# Altium project FMC_130MSPS.PrjPCB (part 3 of 3)

## Sheet ADC.SchDoc: ADC
size 420 x 297 mm; SheetNumber: 2; SheetTotal: 8
Used 4 times, as channels U_ADC1, U_ADC2, U_ADC3, U_ADC4. Parts and nets are listed once, with the designators drawn on the sheet.
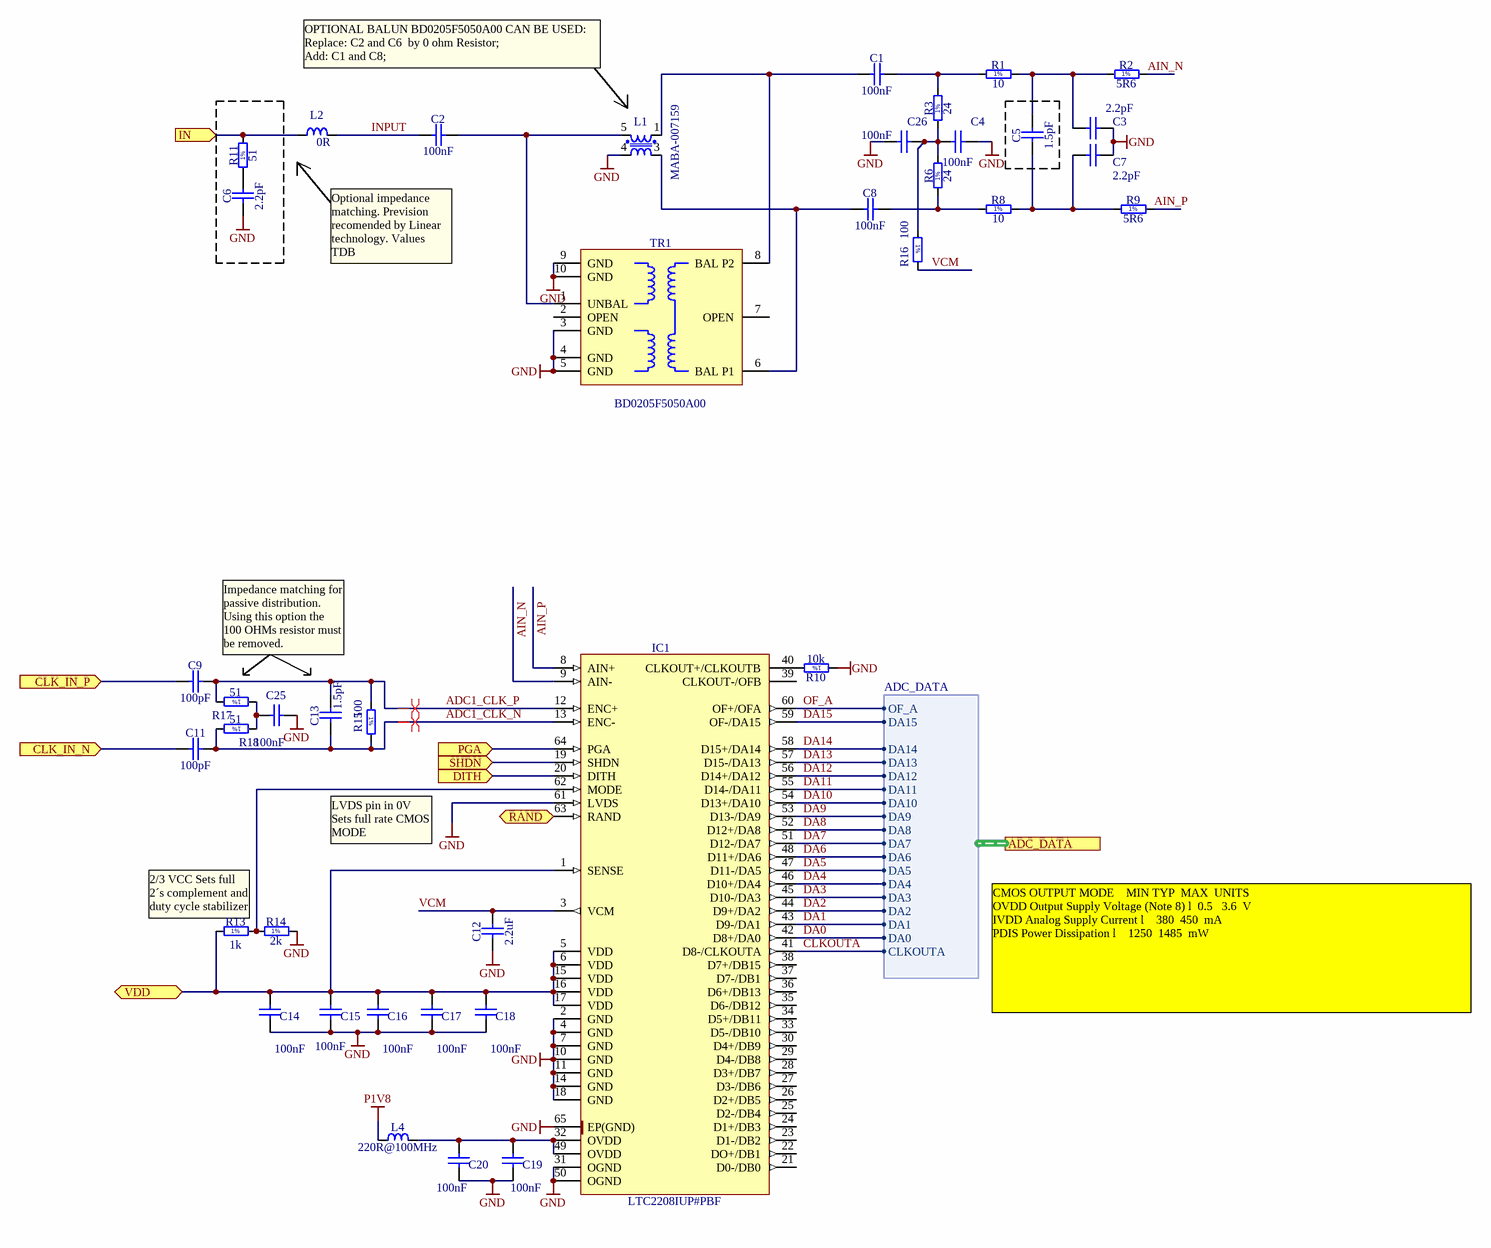
[diagram p5: ADC.SchDoc]

### Parts
C1  100nF  [CAPC0603X33N]
C2  100nF  [CAPC0603X33N]
C3  2.2pF  [CAPC1005X55N]
C4  100nF  [CAPC0603X33N]
C5  1.5pF  [CAPC1005X55N]
C6  2.2pF  [CAPC1005X55N]
C7  2.2pF  [CAPC1005X55N]
C8  100nF  [CAPC0603X33N]
C9  100pF  [CAPC1005X55N]
C11  100pF  [CAPC1005X55N]
C12  2.2uF  [CAPC1608X87N]
C13  1.5pF  [CAPC1005X55N]
C14  100nF  [CAPC0603X33N]
C15  100nF  [CAPC0603X33N]
C16  100nF  [CAPC0603X33N]
C17  100nF  [CAPC0603X33N]
C18  100nF  [CAPC0603X33N]
C19  100nF  [CAPC0603X33N]
C20  100nF  [CAPC0603X33N]
C25  100nF  [CAPC0603X33N]
C26  100nF  [CAPC0603X33N]
IC1  LTC2208IUP#PBF  [QFN50P900X900X80-65N-S725]
L1  MABA-007159  [XFMR_MA-COM_SM-22 (H260)]
L2  0R  [INDC1005X55N]
L4  220R@100MHz  [INDC2012X105N]
R1  10  [RESC1005X40N]
R2  5R6  [RESC1005X40N]
R3  24  [RESC1005X40N]
R6  24  [RESC1005X40N]
R8  10  [RESC1005X40N]
R9  5R6  [RESC1005X40N]
R10  10k  [RESC1005X40N]
R11  51  [RESC1005X40N]
R13  1k  [RESC1005X40N]
R14  2k  [RESC1005X40N]
R15  100  [RESC1005X40N]
R16  100  [RESC1005X40N]
R17  51  [RESC1005X40N]
R18  51  [RESC1005X40N]
TR1  BD0205F5050A00  [XFMR_ANAREN_BD0205F5050A00]

### Ports
ADC_DATA (harness ADC_DATA), CLK_IN_N (in), CLK_IN_P (in), DITH (in), IN (in), PGA (in), RAND (in), SHDN (in), VDD

### Harnesses
ADC_DATA: CLKOUTA, DA0, DA1, DA2, DA3, DA4, DA5, DA6, DA7, DA8, DA9, DA10, DA11, DA12, DA13, DA14, DA15, OF_A

### Nets
GND: C3.2 C4.2 C6.1 C7.2 C12.1 C14.1 C15.1 C16.1 C17.1 C18.1 C19.1 C20.1 C25.1 C26.2 IC1.2(GND) IC1.4(GND) IC1.7(GND) IC1.10(GND) IC1.11(GND) IC1.14(GND) IC1.18(GND) IC1.31(OGND) IC1.50(OGND) IC1.61(LVDS) IC1.65(EP(GND)) L1.4 R10.1 R14.2 TR1.3(GND) TR1.4(GND) TR1.5(GND) TR1.9(GND) TR1.10(GND)
P1V8: L4.1
ADC1_CLK_N: C11.2 C13.1 IC1.13(ENC-) R15.2 R18.2
ADC1_CLK_P: C9.2 C13.2 IC1.12(ENC+) R15.1 R17.2
AIN_N: IC1.9(AIN-) R2.2
AIN_P: IC1.8(AIN+) R9.2
CLK_IN_N: C11.1 ; port CLK_IN_N
CLK_IN_P: C9.1 ; port CLK_IN_P
CLKOUTA: IC1.41(D8-/CLKOUTA) ; port ADC_DATA.CLKOUTA
DA0: IC1.42(D8+/DA0) ; port ADC_DATA.DA0
DA1: IC1.43(D9-/DA1) ; port ADC_DATA.DA1
DA2: IC1.44(D9+/DA2) ; port ADC_DATA.DA2
DA3: IC1.45(D10-/DA3) ; port ADC_DATA.DA3
DA4: IC1.46(D10+/DA4) ; port ADC_DATA.DA4
DA5: IC1.47(D11-/DA5) ; port ADC_DATA.DA5
DA6: IC1.48(D11+/DA6) ; port ADC_DATA.DA6
DA7: IC1.51(D12-/DA7) ; port ADC_DATA.DA7
DA8: IC1.52(D12+/DA8) ; port ADC_DATA.DA8
DA9: IC1.53(D13-/DA9) ; port ADC_DATA.DA9
DA10: IC1.54(D13+/DA10) ; port ADC_DATA.DA10
DA11: IC1.55(D14-/DA11) ; port ADC_DATA.DA11
DA12: IC1.56(D14+/DA12) ; port ADC_DATA.DA12
DA13: IC1.57(D15-/DA13) ; port ADC_DATA.DA13
DA14: IC1.58(D15+/DA14) ; port ADC_DATA.DA14
DA15: IC1.59(OF-/DA15) ; port ADC_DATA.DA15
DITH: IC1.20(DITH) ; port DITH
IN: L2.1 R11.2 ; port IN
INPUT: C2.1 L2.2
OF_A: IC1.60(OF+/OFA) ; port ADC_DATA.OF_A
PGA: IC1.64(PGA) ; port PGA
RAND: IC1.63(RAND) ; port RAND
SHDN: IC1.19(SHDN) ; port SHDN
VCM: C12.2 IC1.3(VCM) R16.2
VDD: C14.2 C15.2 C16.2 C17.2 C18.2 IC1.1(SENSE) IC1.5(VDD) IC1.6(VDD) IC1.15(VDD) IC1.16(VDD) IC1.17(VDD) R13.1 ; port VDD
NetC1_1: C1.1 L1.1 TR1.8(BAL_P2)
NetC1_2: C1.2 R1.1 R3.2
NetC2_2: C2.2 L1.5 TR1.1(UNBAL)
NetC3_1: C3.1 C5.2 R1.2 R2.1
NetC4_1: C4.1 C26.1 R3.1 R6.2 R16.1
NetC5_1: C5.1 C7.1 R8.2 R9.1
NetC6_2: C6.2 R11.1
NetC8_1: C8.1 L1.3 TR1.6(BAL_P1)
NetC8_2: C8.2 R6.1 R8.1
NetC19_2: C19.2 C20.2 IC1.32(OVDD) IC1.49(OVDD) L4.2
NetC25_2: C25.2 R17.1 R18.1
NetIC1_40: IC1.40(CLKOUT+/CLKOUTB) R10.2
NetIC1_62: IC1.62(MODE) R13.2 R14.1

Not connected (* = marked no-connect by the designer): IC1 21(D0-/DB0) 22(DO+/DB1) 23(D1-/DB2) 24(D1+/DB3) 25(D2-/DB4) 26(D2+/DB5) 27(D3-/DB6) 28(D3+/DB7) 29(D4-/DB8) 30(D4+/DB9) 33(D5-/DB10) 34(D5+/DB11) 35(D6-/DB12) 36(D6+/DB13) 37(D7-/DB1) 38(D7+/DB15) 39(CLKOUT-/OFB); TR1 2(OPEN) 7(OPEN)

### Channels
U_ADC1: designators end in A; ports CLK_IN_N=ADC1_CLK_N CLK_IN_P=ADC1_CLK_P DITH=DITH_ON_OFF IN=NetJ6_1 PGA=PGA_1_0 RAND=RAND_ON_OFF SHDN=SHDN_ON_OFF VDD=P3V3_ADC1
U_ADC2: designators end in B; ports CLK_IN_N=ADC2_CLK_N CLK_IN_P=ADC2_CLK_P DITH=DITH_ON_OFF IN=NetJ8_1 PGA=PGA_1_0 RAND=RAND_ON_OFF SHDN=SHDN_ON_OFF VDD=P3V3_ADC2
U_ADC3: designators end in C; ports CLK_IN_N=ADC3_CLK_N CLK_IN_P=ADC3_CLK_P DITH=DITH_ON_OFF IN=NetJ7_1 PGA=PGA_1_0 RAND=RAND_ON_OFF SHDN=SHDN_ON_OFF VDD=P3V3_ADC3
U_ADC4: designators end in D; ports CLK_IN_N=ADC4_CLK_N CLK_IN_P=ADC4_CLK_P DITH=DITH_ON_OFF IN=NetJ5_1 PGA=PGA_1_0 RAND=RAND_ON_OFF SHDN=SHDN_ON_OFF VDD=P3V3_ADC4

### Layout directives
differential pair: ADC1_CLK_N_U_ADC1, ADC1_CLK_P_U_ADC1

### Notes on the sheet
- OPTIONAL BALUN BD0205F5050A00 CAN BE USED:
  Replace: C2 and C6  by 0 ohm Resistor;
  Add: C1 and C8;
- Optional impedance matching. Prevision recomended by Linear technology. Values TDB
- Impedance matching for passive distribution. Using this option the 100 OHMs resistor must be removed.
- LVDS pin in 0V Sets full rate CMOS MODE
- 2/3 VCC Sets full 2´s complement and duty cycle stabilizer
- CMOS OUTPUT MODE 	 	MIN	TYP 	MAX 	UNITS
  OVDD Output Supply Voltage (Note 8) l 	0.5 		3.6 	V
  IVDD Analog Supply Current l 			380 	450	 mA
  PDIS Power Dissipation l 			1250 	1485 	mW
- Project/Equipment
- Document
- FMC_130MSPS_4CH
- Designer
- Drawn by
- Check.by
- Copyright Creotech Instruments SA 2014.
  This documentation describes Open Hardware and is licensed under the CERN OHL v.1.1. You may redistribute and modify this documentation under the terms of the CERN OHL v.1.1. (http://ohwr.org/CERNOHL). This documentation is distributed WITHOUT ANY EXPRESS OR IMPLIED WARRANTY, INCLUDING OF MERCHANTABILITY, SATISFACTORY QUALITY AND FITNESS FOR A PARTICULAR PURPOSE. Please see the CERN OHL v.1.1 for applicable conditions.
- Creotech Instruments S.A.
- File
- Last Mod.
- Print Date
- Sheet
- Size
- A3
- of
- Rev
- (in symbol R0402_1K_1%_0.0625W_100PPM) 1%
- (in symbol R0402_2K_1%_0.0625W_100PPM) 1%
- (in symbol R0402_5R6_1%_0.0625W_200PPM) 1%
- (in symbol R0402_10K_1%_0.0625W_100PPM) 1%
- (in symbol R0402_10R_1%_0.0625W_200PPM) 1%
- (in symbol R0402_24R_1%_0.0625W_100PPM) 1%
- (in symbol R0402_51R_1%_0.0625W_100PPM) 1%
- (in symbol R0402_100R_1%_0.0625W_100PPM) 1%

### Library data of the parts
C1 C2 C4 C8 C14-C20 C25 C26 = CC0201_100NF_6.3V_10%_X5R: Non-polarised capacitor; Part Description: SMD Multilayer Chip Ceramic Capacitor; Manufacturer: GENERIC; Manufacturer1 Part Number: 02016D104KAT2A; Voltage: 6.3V; TC: X5R; Tolerance: ±10%; Table: Capacitors SMD; Part Number: CC0201_100NF_6.3V_10%_X5R; Component Kind: Standard; Component Type: Standard; Pin Count: 2; Value: 100nF; Status: Not Recommended; Manufacturer Part Number: CC0201_100NF_6.3V_10%_X5R; Case: 0201; Mounted: Yes; Socket: No; SMD: Yes; Manufacturer1 Example: AVX; Manufacturer1 ComponentHeight: 0.33mm; HelpURL: \\cern.ch\dfs\Applications\Altium\Datasheets\CC0201_X5R_AVX.pdf; Author: CERN DEM JLC; CreateDate: 2007-12-03; LatestRevisionDate: 2007-12-03
C3 C6 C7 = CC0402_2.2PF_50V_0.25PF_NP0: Non-polarised capacitor; Part Description: SMD Multilayer Chip Ceramic Capacitor; Manufacturer: GENERIC; Manufacturer1 Part Number: 223886915228; Voltage: 50V; TC: NP0; Tolerance: ±0.25pF; Table: Capacitors SMD; Part Number: CC0402_2.2PF_50V_0.25PF_NP0; Component Kind: Standard; Component Type: Standard; Pin Count: 2; Value: 2.2pF; Status: Not Recommended; Manufacturer Part Number: CC0402_2.2PF_50V_0.25PF_NP0; Case: 0402; Mounted: Yes; Socket: No; SMD: Yes; Manufacturer1 Example: PHYCOMP; Manufacturer1 ComponentHeight: 0.55mm; HelpURL: \\cern.ch\dfs\Applications\Altium\Datasheets\CC0402_NP0_PHYCOMP.pdf; Author: CERN DEM JLC
  C3 C7: CreateDate: 3/12/2007; LatestRevisionDate: 3/12/2007
  C6: CreateDate: 2007-12-03; LatestRevisionDate: 2007-12-03
C5 C13 = CC0402_1.5PF_50V_0.25PF_NP0: Non-polarised capacitor; Part Description: SMD Multilayer Chip Ceramic Capacitor; Manufacturer: GENERIC; Manufacturer1 Part Number: 223886915158; Voltage: 50V; TC: NP0; Tolerance: ±0.25pF; Table: Capacitors SMD; Part Number: CC0402_1.5PF_50V_0.25PF_NP0; Component Kind: Standard; Component Type: Standard; Pin Count: 2; Value: 1.5pF; Status: Not Recommended; Manufacturer Part Number: CC0402_1.5PF_50V_0.25PF_NP0; Case: 0402; Mounted: Yes; Socket: No; SMD: Yes; Manufacturer1 Example: PHYCOMP; Manufacturer1 ComponentHeight: 0.55mm; HelpURL: \\cern.ch\dfs\Applications\Altium\Datasheets\CC0402_NP0_PHYCOMP.pdf; Author: CERN DEM JLC; CreateDate: 3/12/2007; LatestRevisionDate: 3/12/2007
C9 C11 = CC0402_100PF_50V_5%_NP0: Non-polarised capacitor; Part Description: SMD Multilayer Chip Ceramic Capacitor; Manufacturer: GENERIC; Manufacturer1 Part Number: 223886915101; Voltage: 50V; TC: NP0; Tolerance: ±5%; Table: Capacitors SMD; Part Number: CC0402_100PF_50V_5%_NP0; Component Kind: Standard; Component Type: Standard; Pin Count: 2; Value: 100pF; Status: Not Recommended; Manufacturer Part Number: CC0402_100PF_50V_5%_NP0; Case: 0402; Mounted: Yes; Socket: No; SMD: Yes; Manufacturer1 Example: PHYCOMP; Manufacturer1 ComponentHeight: 0.55mm; HelpURL: \\cern.ch\dfs\Applications\Altium\Datasheets\CC0402_NP0_PHYCOMP.pdf; Author: CERN DEM JLC; CreateDate: 3/12/2007; LatestRevisionDate: 3/12/2007
C12 = CC0603_2.2UF_16V_10%_X5R: Non-polarised capacitor; Part Description: SMD Multilayer Chip Ceramic Capacitor; Manufacturer: GENERIC; Manufacturer1 Part Number: CC0603KRX5R7BB225; Voltage: 16V; TC: X5R; Tolerance: ±10%; Table: Capacitors SMD; Part Number: CC0603_2.2UF_16V_10%_X5R; Component Kind: Standard; Component Type: Standard; Pin Count: 2; Value: 2.2uF; Status: Preferred; Manufacturer Part Number: CC0603_2.2UF_16V_10%_X5R; Case: 0603; Mounted: Yes; Socket: No; SMD: Yes; Manufacturer1 Example: YAGEO; Manufacturer1 ComponentHeight: 0.9mm; HelpURL: \\cern.ch\dfs\Applications\Altium\Datasheets\CC0805_X5R_PHYCOMP_HC.pdf; Author: CERN DEM JLC; CreateDate: 28/4/2011; LatestRevisionDate: 28/4/2011
IC1 = LTC2LTC2208IUP#PBF: 16-Bit, 130Msps ADC; Manufacturer: LINEAR TECHNOLOGY; Table: Analog & Interface; Part Number: LTC2LTC2208IUP#PBF; Component Kind: Standard; Component Type: Standard; Device: LTC2208IUP#PBF; PackageDescription: QFN, 0.50mm Pitch, Square; 64 Pin, 9.00mm L X 9.00mm W X 0.80mm H body (7.25mm X 7.25mm Thermal Tab), IPC Medium Density; Part Description: 16-Bit, 130Msps ADC; Manufacturer Part Number: LTC2208IUP#PBF; Pin Count: 65; Case: QFN64; Mounted: Yes; Socket: No; SMD: Yes; ComponentHeight: 0.8mm; Author: CERN DEM JLC; HelpURL: \\cern.ch\dfs\Applications\Altium\Datasheets\LTC2208IUP#PBF.pdf; CreateDate: 18/9/2012; LatestRevisionDate: 18/9/2012
L1 = XFMR_MA-COM_MABA-007159-000000_modified: MA-COM E-Serie RF 1:1 Transmission Line Ttransformer 4.5-3000MHz; name: MABA-007159
L2 = IND0402_MURATA_BLM15HB221SN1: Inductor; Part Description: SMD EMIFIL Suppression Chip Ferrite Bead; Manufacturer: MURATA; Value: 220R@100MHz; Power: 250mA; Resistance: 1R; Tolerance: ±25%; Table: Inductors SMD; Part Number: IND0402_MURATA_BLM15HB221SN1; Component Kind: Standard; Component Type: Standard; Pin Count: 2; Status: None; Manufacturer Part Number: BLM15HB221SN1; Case: 0402; Mounted: Yes; Socket: No; SMD: Yes; ComponentHeight: 0.55mm; HelpURL: \\cern.ch\dfs\Applications\Altium\Datasheets\IND0402_MURATA_BLM15H.pdf; Author: CERN DEM JLC; CreateDate: 23/6/2009; LatestRevisionDate: 23/6/2009
L4 = IND0805_MURATA_BLM21PG221SN1D: Inductor; Part Description: SMD EMIFIL Suppression Chip Ferrite Bead; Manufacturer: MURATA; Power: 2A; Resistance: 0.05R; Tolerance: ±25%; Table: Inductors SMD; Part Number: IND0805_MURATA_BLM21PG221SN1D; Component Kind: Standard; Component Type: Standard; Pin Count: 2; Value: 220R@100MHz; Status: None; Manufacturer Part Number: BLM21PG221SN1D; Case: 0805; Mounted: Yes; Socket: No; SMD: Yes; ComponentHeight: 1.05mm; HelpURL: \\cern.ch\dfs\Applications\Altium\Datasheets\IND0402_MURATA_BLM21P.pdf; Author: CERN DEM JLC; CreateDate: 25/1/2010; LatestRevisionDate: 25/1/2010
R1 R8 = R0402_10R_1%_0.0625W_200PPM: Resistor - 1%; Part Description: General Purpose Thick Film Chip Resistor; Manufacturer: GENERIC; Manufacturer1 Part Number: 232270671009L; TC: ±200ppm/°C; Table: Resistors SMD; Part Number: R0402_10R_1%_0.0625W_200PPM; Component Kind: Standard; Component Type: Standard; Pin Count: 2; Value: 10; Status: Not recommended; Power: 0.0625W; Tolerance: ±1%; Manufacturer Part Number: R0402_10R_1%_0.0625W_200PPM; Case: 0402; Mounted: Yes; Socket: No; SMD: Yes; Manufacturer1 Example: YAGEO PHYCOMP; Manufacturer1 ComponentHeight: 0.4mm; HelpURL: \\cern.ch\dfs\Applications\Altium\Datasheets\R0402_Phycomp_RC0402.pdf; Author: CERN DEM JLC; CreateDate: 24/6/2009; LatestRevisionDate: 17/10/2012
R2 R9 = R0402_5R6_1%_0.0625W_200PPM: Resistor - 1%; Part Description: General Purpose Thick Film Chip Resistor; Manufacturer: GENERIC; Manufacturer1 Part Number: 232270675608L; TC: ±200ppm/°C; Table: Resistors SMD; Part Number: R0402_5R6_1%_0.0625W_200PPM; Component Kind: Standard; Component Type: Standard; Pin Count: 2; Value: 5R6; Status: Not recommended; Power: 0.0625W; Tolerance: ±1%; Manufacturer Part Number: R0402_5R6_1%_0.0625W_200PPM; Case: 0402; Mounted: Yes; Socket: No; SMD: Yes; Manufacturer1 Example: YAGEO PHYCOMP; Manufacturer1 ComponentHeight: 0.4mm; HelpURL: \\cern.ch\dfs\Applications\Altium\Datasheets\R0402_Phycomp_RC0402.pdf; Author: CERN DEM JLC; CreateDate: 24/6/2009; LatestRevisionDate: 17/10/2012
R3 R6 = R0402_24R_1%_0.0625W_100PPM: Resistor - 1%; Part Description: General Purpose Thick Film Chip Resistor; Manufacturer: GENERIC; Manufacturer1 Part Number: 232270672409L; TC: ±100ppm/°C; Table: Resistors SMD; Part Number: R0402_24R_1%_0.0625W_100PPM; Component Kind: Standard; Component Type: Standard; Pin Count: 2; Value: 24; Status: Not recommended; Power: 0.0625W; Tolerance: ±1%; Manufacturer Part Number: R0402_24R_1%_0.0625W_100PPM; Case: 0402; Mounted: Yes; Socket: No; SMD: Yes; Manufacturer1 Example: YAGEO PHYCOMP; Manufacturer1 ComponentHeight: 0.4mm; HelpURL: \\cern.ch\dfs\Applications\Altium\Datasheets\R0402_Phycomp_RC0402.pdf; Author: CERN DEM JLC; CreateDate: 3/12/2007; LatestRevisionDate: 17/10/2012
R10 = R0402_10K_1%_0.0625W_100PPM: Resistor - 1%; Part Description: General Purpose Thick Film Chip Resistor; Manufacturer: GENERIC; Manufacturer1 Part Number: 232270671003L; TC: ±100ppm/°C; Table: Resistors SMD; Part Number: R0402_10K_1%_0.0625W_100PPM; Component Kind: Standard; Component Type: Standard; Pin Count: 2; Value: 10k; Status: Not recommended; Power: 0.0625W; Tolerance: ±1%; Manufacturer Part Number: R0402_10K_1%_0.0625W_100PPM; Case: 0402; Mounted: Yes; Socket: No; SMD: Yes; Manufacturer1 Example: YAGEO PHYCOMP; Manufacturer1 ComponentHeight: 0.4mm; HelpURL: \\cern.ch\dfs\Applications\Altium\Datasheets\R0402_Phycomp_RC0402.pdf; Author: CERN DEM JLC; CreateDate: 3/12/2007; LatestRevisionDate: 17/10/2012
R11 R17 R18 = R0402_51R_1%_0.0625W_100PPM: Resistor - 1%; Part Description: General Purpose Thick Film Chip Resistor; Manufacturer: GENERIC; Manufacturer1 Part Number: 232270675109L; TC: ±100ppm/°C; Table: Resistors SMD; Part Number: R0402_51R_1%_0.0625W_100PPM; Component Kind: Standard; Component Type: Standard; Pin Count: 2; Value: 51; Status: Not recommended; Power: 0.0625W; Tolerance: ±1%; Manufacturer Part Number: R0402_51R_1%_0.0625W_100PPM; Case: 0402; Mounted: Yes; Socket: No; SMD: Yes; Manufacturer1 Example: YAGEO PHYCOMP; Manufacturer1 ComponentHeight: 0.4mm; HelpURL: \\cern.ch\dfs\Applications\Altium\Datasheets\R0402_Phycomp_RC0402.pdf; Author: CERN DEM JLC; CreateDate: 3/12/2007; LatestRevisionDate: 17/10/2012
R13 = R0402_1K_1%_0.0625W_100PPM: Resistor - 1%; Part Description: General Purpose Thick Film Chip Resistor; Manufacturer: GENERIC; Manufacturer1 Part Number: 232270671002L; TC: ±100ppm/°C; Table: Resistors SMD; Part Number: R0402_1K_1%_0.0625W_100PPM; Component Kind: Standard; Component Type: Standard; Pin Count: 2; Value: 1k; Status: Not recommended; Power: 0.0625W; Tolerance: ±1%; Manufacturer Part Number: R0402_1K_1%_0.0625W_100PPM; Case: 0402; Mounted: Yes; Socket: No; SMD: Yes; Manufacturer1 Example: YAGEO PHYCOMP; Manufacturer1 ComponentHeight: 0.4mm; HelpURL: \\cern.ch\dfs\Applications\Altium\Datasheets\R0402_Phycomp_RC0402.pdf; Author: CERN DEM JLC; CreateDate: 3/12/2007; LatestRevisionDate: 17/10/2012
R14 = R0402_2K_1%_0.0625W_100PPM: Resistor - 1%; Part Description: General Purpose Thick Film Chip Resistor; Manufacturer: GENERIC; Manufacturer1 Part Number: 232270672002L; TC: ±100ppm/°C; Table: Resistors SMD; Part Number: R0402_2K_1%_0.0625W_100PPM; Component Kind: Standard; Component Type: Standard; Pin Count: 2; Value: 2k; Status: Not recommended; Power: 0.0625W; Tolerance: ±1%; Manufacturer Part Number: R0402_2K_1%_0.0625W_100PPM; Case: 0402; Mounted: Yes; Socket: No; SMD: Yes; Manufacturer1 Example: YAGEO PHYCOMP; Manufacturer1 ComponentHeight: 0.4mm; HelpURL: \\cern.ch\dfs\Applications\Altium\Datasheets\R0402_Phycomp_RC0402.pdf; Author: CERN DEM JLC; CreateDate: 3/12/2007; LatestRevisionDate: 17/10/2012
R15 R16 = R0402_100R_1%_0.0625W_100PPM: Resistor - 1%; Part Description: General Purpose Thick Film Chip Resistor; Manufacturer: GENERIC; Manufacturer1 Part Number: 232270671001L; TC: ±100ppm/°C; Table: Resistors SMD; Part Number: R0402_100R_1%_0.0625W_100PPM; Component Kind: Standard; Component Type: Standard; Pin Count: 2; Value: 100; Status: Not recommended; Power: 0.0625W; Tolerance: ±1%; Manufacturer Part Number: R0402_100R_1%_0.0625W_100PPM; Case: 0402; Mounted: Yes; Socket: No; SMD: Yes; Manufacturer1 Example: YAGEO PHYCOMP; Manufacturer1 ComponentHeight: 0.4mm; HelpURL: \\cern.ch\dfs\Applications\Altium\Datasheets\R0402_Phycomp_RC0402.pdf; Author: CERN DEM JLC; CreateDate: 3/12/2007; LatestRevisionDate: 17/10/2012
TR1 = XFMR_ANAREN_BD0205F5050A00: 70MHz - 1000MHz Ultra Low Profile Sub-Miniature Balanced to Unbalanced Transformer; Manufacturer: ANAREN; Table: Transformers; Part Number: XFMR_ANAREN_BD0205F5050A00; Component Kind: Standard; Component Type: Standard; Pin Count: 10; Status: None; Part Description: 70MHz - 1000MHz Ultra Low Profile Sub-Miniature Balanced to Unbalanced Transformer; Manufacturer Part Number: BD0205F5050A00; Mounted: Yes; Socket: No; SMD: Yes; ComponentHeight: 2.60.91; HelpURL: \\cern.ch\dfs\Applications\Altium\Datasheets\XFMR_ANAREN_BD0205F5050A00.pdf; Author: CERN DEM JLC; CreateDate: 2012-10-03; LatestRevisionDate: 2012-10-03

## Sheet Triggers.SchDoc: Triggers
size 420 x 297 mm; SheetNumber: 7; SheetTotal: 8
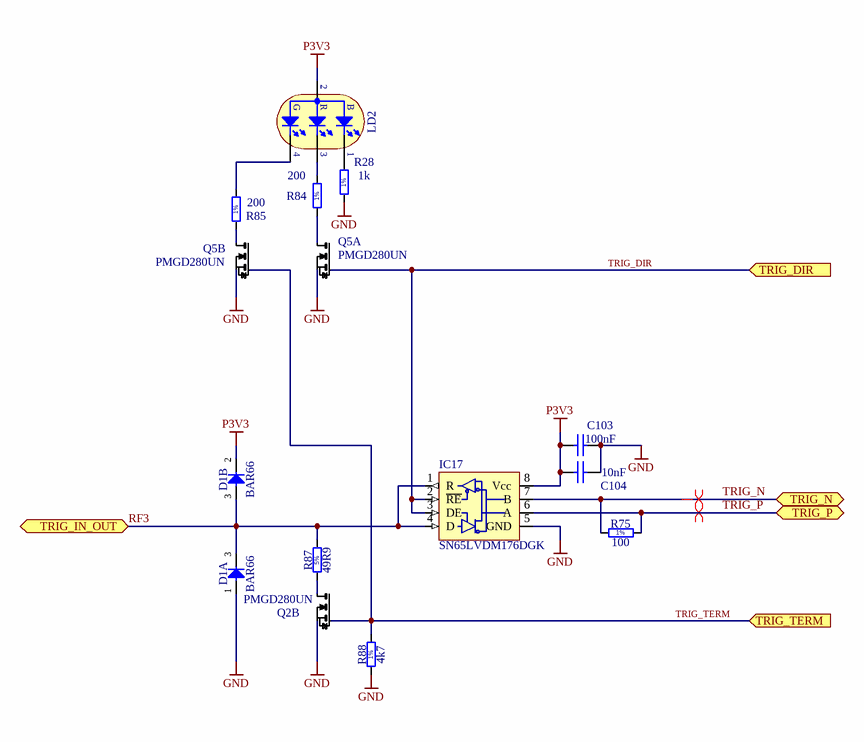
[diagram p6: Triggers.SchDoc]

### Parts
C103  100nF  [CAPC0603X33N]
C104  10nF  [CAPC0603X33N]
D1  BAR66  [SOT95P240X110-3N]  (parts A,B of 2)
IC17  SN65LVDM176DGK  [MSOP8 TI/AD]
LD2  Blue/Red/Green  [LED_AVAGO_HSMF-C113]  (value not drawn)
Q2  PMGD280UN  [SOT-363]  (part B of 2)
Q5  PMGD280UN  [SOT-363]  (parts A,B of 2)
R28  1k  [RESC1005X40N]
R75  100  [RESC1005X40N]
R84  200  [RESC1005X40N]
R85  200  [RESC1005X40N]
R87  49R9  [RESC3225X70N]
R88  4k7  [RESC1005X40N]

### Ports
TRIG_DIR (in), TRIG_IN_OUT (bidir), TRIG_N (bidir), TRIG_P (bidir), TRIG_TERM (in)

### Nets
GND: C103.2 C104.2 D1.1(A) IC17.5(GND) Q2.4(S1) Q5.1(S1) Q5.4(S1) R28.1 R88.1
P3V3: C103.1 C104.1 D1.2(C) IC17.8(Vcc) LD2.2(AC)
RF3: D1.3(COMAC) IC17.1(R) IC17.4(D) R87.2 ; port TRIG_IN_OUT
TRIG_DIR: IC17.2(~{RE}) IC17.3(DE) Q5.2(G1) ; port TRIG_DIR  [project net LA28_P]
TRIG_N: IC17.7(B) R75.1 ; port TRIG_N  [project net LA32_N]
TRIG_P: IC17.6(A) R75.2 ; port TRIG_P  [project net LA32_P]
TRIG_TERM: Q2.5(G1) Q5.5(G1) R88.2 ; port TRIG_TERM  [project net LA26_N]
NetLD2_1: LD2.1(CB) R28.2
NetLD2_3: LD2.3(CR) R84.2
NetLD2_4: LD2.4(CG) R85.2
NetQ2_6: Q2.6(D1) R87.1
NetQ5_3: Q5.3(D1) R84.1
NetQ5_6: Q5.6(D1) R85.1

### Layout directives
differential pair: LA32_N, LA32_P

### Notes on the sheet
- Project/Equipment
- Document
- FMC_130MSPS_4CH
- Designer
- Drawn by
- Check.by
- Copyright Creotech Instruments SA 2014.
  This documentation describes Open Hardware and is licensed under the CERN OHL v.1.1. You may redistribute and modify this documentation under the terms of the CERN OHL v.1.1. (http://ohwr.org/CERNOHL). This documentation is distributed WITHOUT ANY EXPRESS OR IMPLIED WARRANTY, INCLUDING OF MERCHANTABILITY, SATISFACTORY QUALITY AND FITNESS FOR A PARTICULAR PURPOSE. Please see the CERN OHL v.1.1 for applicable conditions.
- Creotech Instruments S.A.
- File
- Last Mod.
- Print Date
- Sheet
- Size
- A3
- of
- Rev
- (in symbol LED_AVAGO_HSMF-C113) G; R; B
- (in symbol R0402_1K_1%_0.0625W_100PPM) 1%
- (in symbol R0402_4K7_1%_0.0625W_100PPM) 1%
- (in symbol R0402_100R_1%_0.0625W_100PPM) 1%
- (in symbol R0402_200R_1%_0.0625W_100PPM) 1%
- (in symbol R1210_270R_5%_0.5W_200PPM) 5%

### Library data of the parts
C103 = CC0201_100NF_6.3V_10%_X5R: as C1 on sheet ADC; Part Number: CC0201_100NF_6.3V_10%_X5R; Component Kind: Standard; Component Type: Standard; Pin Count: 2; Value: 100nF; Status: Not Recommended; Manufacturer Part Number: CC0201_100NF_6.3V_10%_X5R; Case: 0201; Mounted: Yes; Socket: No; SMD: Yes; Manufacturer1 Example: AVX; Manufacturer1 ComponentHeight: 0.33mm; HelpURL: \\cern.ch\dfs\Applications\Altium\Datasheets\CC0201_X5R_AVX.pdf; Author: CERN DEM JLC; CreateDate: 2007-12-03; LatestRevisionDate: 2007-12-03
C104 = CC0201_10NF_10V_10%_X5R: Non-polarised capacitor; Part Description: SMD Multilayer Chip Ceramic Capacitor; Manufacturer: GENERIC; Manufacturer1 Part Number: 0201ZD103KAT2A; Voltage: 10V; TC: X5R; Tolerance: ±10%; Table: Capacitors SMD; Part Number: CC0201_10NF_10V_10%_X5R; Component Kind: Standard; Component Type: Standard; Pin Count: 2; Value: 10nF; Status: Not Recommended; Manufacturer Part Number: CC0201_10NF_10V_10%_X5R; Case: 0201; Mounted: Yes; Socket: No; SMD: Yes; Manufacturer1 Example: AVX; Manufacturer1 ComponentHeight: 0.33mm; HelpURL: \\cern.ch\dfs\Applications\Altium\Datasheets\CC0201_X5R_AVX.pdf; Author: CERN DEM JLC; CreateDate: 2007-12-03; LatestRevisionDate: 2007-12-03
D1 = BAR66: Serial Diode; Part Description: Silicon PIN Diode Array (Series Connected); Manufacturer: INFINEON; Voltage: 150V; Power: 250mA; Table: Diodes; Part Number: BAR66; Component Kind: Standard; Component Type: Standard; Device: BAR66; PackageDescription: SOT23 3-Leads, Pitch 0.95mm - Body 1.3x2.9mm, IPC Medium Density; Manufacturer Part Number: BAR66; Pin Count: 3; Case: SOT23; Mounted: Yes; Socket: No; SMD: Yes; ComponentHeight: 1.1mm; HelpURL: \\cern.ch\dfs\Applications\Altium\Datasheets\BAR66.pdf; Author: CERN DEM JLC; CreateDate: 18/1/2010; LatestRevisionDate: 5/10/2010
IC17 = SN65LVDM176: High Speed Differential Transceiver LVDS/LVTTL; ComponentLink1Description: Datasheet; ComponentLink1URL: C:\TSR\Laurin\Projects\FMC\CERN DAC\Parts\Digital\SN65LVDM176.pdf
LD2 = LED_AVAGO_HSMF-C113: Tricolor LEDs 1 Cathode Blue, 2 Common Anode, 3 Cathode Red, 4 Cathode Green; Part Description: Right Angle Tricolor (Blue, Red, Green) Surface Mount ChipLED; Manufacturer: AVAGO TECHNOLOGIES; Table: LEDs & Displays; Part Number: LED_AVAGO_HSMF-C113; Component Kind: Standard; Component Type: Standard; Color: Blue/Red/Green; PackageDescription: Right Angle Tricolor Surface Mount ChipLED, Body 2.5x1mm; Manufacturer Part Number: HSMF-C113; Pin Count: 4; Mounted: Yes; Socket: No; SMD: Yes; ComponentHeight: 1mm; HelpURL: \\cern.ch\dfs\Applications\Altium\Datasheets\LED_AVAGO_HSMF-C113.pdf; Author: CERN DEM JLC; CreateDate: 2010-09-29; LatestRevisionDate: 2010-09-29
Q2 Q5 = Q_PMGD280UN: Dual NMOS 20V,08.A, 340mR, Vt=0.7V
R28 = R0402_1K_1%_0.0625W_100PPM: Resistor - 1%; Part Description: General Purpose Thick Film Chip Resistor; Manufacturer: GENERIC; Manufacturer1 Part Number: 232270671002; TC: ±100ppm/°C; Table: Resistors SMD; Part Number: R0402_1K_1%_0.0625W_100PPM; Component Kind: Standard; Component Type: Standard; Pin Count: 2; Value: 1k; Status: Not recommended; Power: 0.0625W; Tolerance: ±1%; Manufacturer Part Number: R0402_1K_1%_0.0625W_100PPM; Case: 0402; Mounted: Yes; Socket: No; SMD: Yes; Manufacturer1 Example: PHYCOMP; Manufacturer1 ComponentHeight: 0.4mm; HelpURL: \\cern.ch\dfs\Applications\Altium\Datasheets\R0402_Phycomp_RC0402.pdf; Author: CERN DEM JLC; CreateDate: 2007-12-03; LatestRevisionDate: 2008-03-13
R75 = R0402_100R_1%_0.0625W_100PPM: Resistor - 1%; Part Description: General Purpose Thick Film Chip Resistor; Manufacturer: GENERIC; Manufacturer1 Part Number: 232270671001; TC: ±100ppm/°C; Table: Resistors SMD; Part Number: R0402_100R_1%_0.0625W_100PPM; Component Kind: Standard; Component Type: Standard; Pin Count: 2; Value: 100; Status: Not recommended; Power: 0.0625W; Tolerance: ±1%; Manufacturer Part Number: R0402_100R_1%_0.0625W_100PPM; Case: 0402; Mounted: Yes; Socket: No; SMD: Yes; Manufacturer1 Example: PHYCOMP; Manufacturer1 ComponentHeight: 0.4mm; HelpURL: \\cern.ch\dfs\Applications\Altium\Datasheets\R0402_Phycomp_RC0402.pdf; Author: CERN DEM JLC; CreateDate: 2007-12-03; LatestRevisionDate: 2008-03-13
R84 R85 = R0402_200R_1%_0.0625W_100PPM: Resistor - 1%; Part Description: General Purpose Thick Film Chip Resistor; Manufacturer: GENERIC; Manufacturer1 Part Number: 232270672001; TC: ±100ppm/°C; Table: Resistors SMD; Part Number: R0402_200R_1%_0.0625W_100PPM; Component Kind: Standard; Component Type: Standard; Pin Count: 2; Value: 200; Status: Not recommended; Power: 0.0625W; Tolerance: ±1%; Manufacturer Part Number: R0402_200R_1%_0.0625W_100PPM; Case: 0402; Mounted: Yes; Socket: No; SMD: Yes; Manufacturer1 Example: PHYCOMP; Manufacturer1 ComponentHeight: 0.4mm; HelpURL: \\cern.ch\dfs\Applications\Altium\Datasheets\R0402_Phycomp_RC0402.pdf; Author: CERN DEM JLC; CreateDate: 2007-12-03; LatestRevisionDate: 2008-03-13
R87 = R1210_270R_5%_0.5W_200PPM: Resistor - 5%; Part Number: R1210_49R9_1%_0.33W_100PPM; Part Description: General Purpose Thick Film Chip Resistor; Manufacturer: VISHAY; Manufacturer Part Number: CRCW121049R9FK; Power: 0.33W; TC: ±100ppm/°C; Table: Resistors SMD; Component Kind: Standard; Component Type: Standard; Pin Count: 2; Value: 49R9; Status: None; Tolerance: ±5%; Case: 1210; Mounted: Yes; Socket: No; SMD: Yes; ComponentHeight: 0.7mm; HelpURL: \\cern.ch\dfs\Applications\Altium\Datasheets\R1210_PANASONIC_ERJ.pdf; Author: CERN DEM JLC; CreateDate: 2011-10-26; LatestRevisionDate: 2011-10-26
R88 = R0402_4K7_1%_0.0625W_100PPM: Resistor - 1%; Part Description: General Purpose Thick Film Chip Resistor; Manufacturer: GENERIC; Manufacturer1 Part Number: 232270674702; TC: ±100ppm/°C; Table: Resistors SMD; Part Number: R0402_4K7_1%_0.0625W_100PPM; Component Kind: Standard; Component Type: Standard; Pin Count: 2; Value: 4k7; Status: Not recommended; Power: 0.0625W; Tolerance: ±1%; Manufacturer Part Number: R0402_4K7_1%_0.0625W_100PPM; Case: 0402; Mounted: Yes; Socket: No; SMD: Yes; Manufacturer1 Example: PHYCOMP; Manufacturer1 ComponentHeight: 0.4mm; HelpURL: \\cern.ch\dfs\Applications\Altium\Datasheets\R0402_Phycomp_RC0402.pdf; Author: CERN DEM JLC; CreateDate: 2007-12-03; LatestRevisionDate: 2008-03-13

## Sheet BUFFER.SchDoc: BUFFER
size 420 x 297 mm; SheetNumber: 8; SheetTotal: 8
Used 4 times, as channels U_BUFFER2, U_BUFFER3, U_BUFFER1, U_BUFFER4. Parts and nets are listed once, with the designators drawn on the sheet.
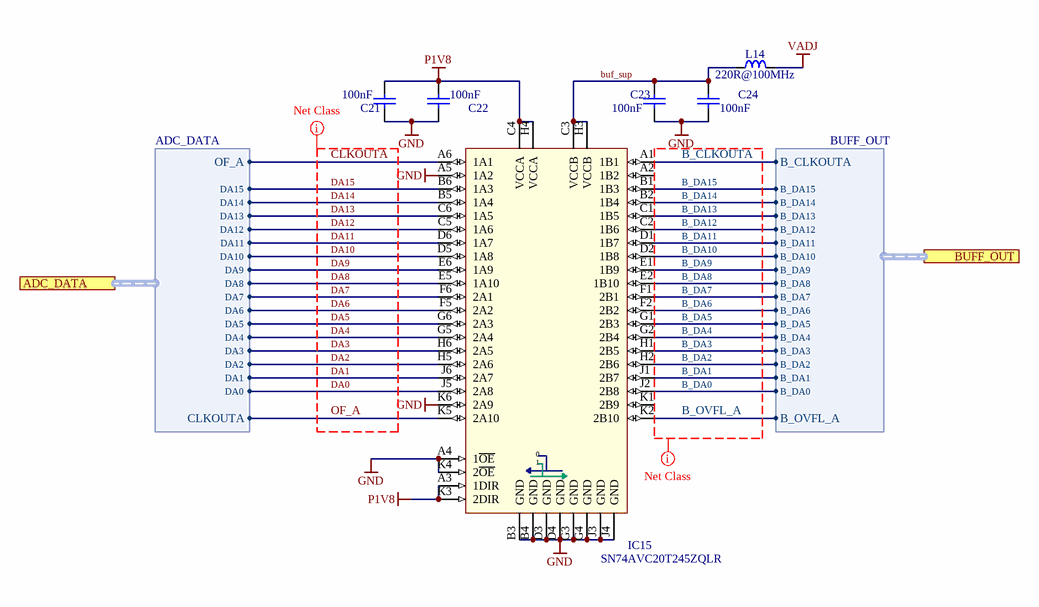
[diagram p7: BUFFER.SchDoc]

### Parts
C21  100nF  [CAPC0603X33N]
C22  100nF  [CAPC0603X33N]
C23  100nF  [CAPC0603X33N]
C24  100nF  [CAPC0603X33N]
IC15  SN74AVC20T245ZQLR  [ZQL56(R-PBGA-N56)]
L14  220R@100MHz  [INDC2012X105N]

### Ports
ADC_DATA (harness ADC_DATA), BUFF_OUT (harness BUFF_OUT)

### Harnesses
BUFF_OUT: B_CLKOUTA, B_OVFL_A, B_DA15, B_DA14, B_DA13, B_DA12, B_DA11, B_DA10, B_DA9, B_DA8, B_DA7, B_DA6, B_DA5, B_DA4, B_DA3, B_DA2, B_DA1, B_DA0
ADC_DATA: CLKOUTA, OF_A, DA15, DA14, DA13, DA12, DA11, DA10, DA9, DA8, DA7, DA6, DA5, DA4, DA3, DA2, DA1, DA0

### Nets
GND: C21.1 C22.1 C23.1 C24.1 IC15.A4(1~{OE}) IC15.A5(1A2) IC15.B3(GND) IC15.B4(GND) IC15.D3(GND) IC15.D4(GND) IC15.G3(GND) IC15.G4(GND) IC15.J3(GND) IC15.J4(GND) IC15.K4(2~{OE}) IC15.K6(2A9)
P1V8: C21.2 C22.2 IC15.A3(1DIR) IC15.C4(VCCA) IC15.H4(VCCA) IC15.K3(2DIR)
VADJ: L14.2
B_CLKOUTA: IC15.A1(1B1) ; port BUFF_OUT.B_CLKOUTA
B_DA0: IC15.J2(2B8) ; port BUFF_OUT.B_DA0
B_DA1: IC15.J1(2B7) ; port BUFF_OUT.B_DA1
B_DA2: IC15.H2(2B6) ; port BUFF_OUT.B_DA2
B_DA3: IC15.H1(2B5) ; port BUFF_OUT.B_DA3
B_DA4: IC15.G2(2B4) ; port BUFF_OUT.B_DA4
B_DA5: IC15.G1(2B3) ; port BUFF_OUT.B_DA5
B_DA6: IC15.F2(2B2) ; port BUFF_OUT.B_DA6
B_DA7: IC15.F1(2B1) ; port BUFF_OUT.B_DA7
B_DA8: IC15.E2(1B10) ; port BUFF_OUT.B_DA8
B_DA9: IC15.E1(1B9) ; port BUFF_OUT.B_DA9
B_DA10: IC15.D2(1B8) ; port BUFF_OUT.B_DA10
B_DA11: IC15.D1(1B7) ; port BUFF_OUT.B_DA11
B_DA12: IC15.C2(1B6) ; port BUFF_OUT.B_DA12
B_DA13: IC15.C1(1B5) ; port BUFF_OUT.B_DA13
B_DA14: IC15.B2(1B4) ; port BUFF_OUT.B_DA14
B_DA15: IC15.B1(1B3) ; port BUFF_OUT.B_DA15
B_OVFL_A: IC15.K2(2B10) ; port BUFF_OUT.B_OVFL_A
buf_sup: C23.2 C24.2 IC15.C3(VCCB) IC15.H3(VCCB) L14.1
CLKOUTA: IC15.A6(1A1) ; port ADC_DATA.OF_A
DA0: IC15.J5(2A8) ; port ADC_DATA.DA0
DA1: IC15.J6(2A7) ; port ADC_DATA.DA1
DA2: IC15.H5(2A6) ; port ADC_DATA.DA2
DA3: IC15.H6(2A5) ; port ADC_DATA.DA3
DA4: IC15.G5(2A4) ; port ADC_DATA.DA4
DA5: IC15.G6(2A3) ; port ADC_DATA.DA5
DA6: IC15.F5(2A2) ; port ADC_DATA.DA6
DA7: IC15.F6(2A1) ; port ADC_DATA.DA7
DA8: IC15.E5(1A10) ; port ADC_DATA.DA8
DA9: IC15.E6(1A9) ; port ADC_DATA.DA9
DA10: IC15.D5(1A8) ; port ADC_DATA.DA10
DA11: IC15.D6(1A7) ; port ADC_DATA.DA11
DA12: IC15.C5(1A6) ; port ADC_DATA.DA12
DA13: IC15.C6(1A5) ; port ADC_DATA.DA13
DA14: IC15.B5(1A4) ; port ADC_DATA.DA14
DA15: IC15.B6(1A3) ; port ADC_DATA.DA15
OF_A: IC15.K5(2A10) ; port ADC_DATA.CLKOUTA

Not connected (* = marked no-connect by the designer): IC15 A2(1B2) K1(2B9)

### Channels
U_BUFFER2: designators end in A
U_BUFFER3: designators end in B
U_BUFFER1: designators end in C
U_BUFFER4: designators end in D

### Layout directives
net class Buff_data: B_CLKOUTA, B_DA0, B_DA1, B_DA2, B_DA3, B_DA4, B_DA5, B_DA6, B_DA7, B_DA8, B_DA9, B_DA10, B_DA11, B_DA12, B_DA13, B_DA14, B_DA15, B_OVFL_A
net class ADC_data: CLKOUTA, DA0, DA1, DA2, DA3, DA4, DA5, DA6, DA7, DA8, DA9, DA10, DA11, DA12, DA13, DA14, DA15, OF_A

### Notes on the sheet
- Project/Equipment
- Document
- FMC_130MSPS_4CH
- Designer
- Drawn by
- Check.by
- Copyright Creotech Instruments SA 2014.
  This documentation describes Open Hardware and is licensed under the CERN OHL v.1.1. You may redistribute and modify this documentation under the terms of the CERN OHL v.1.1. (http://ohwr.org/CERNOHL). This documentation is distributed WITHOUT ANY EXPRESS OR IMPLIED WARRANTY, INCLUDING OF MERCHANTABILITY, SATISFACTORY QUALITY AND FITNESS FOR A PARTICULAR PURPOSE. Please see the CERN OHL v.1.1 for applicable conditions.
- Creotech Instruments S.A.
- File
- Last Mod.
- Print Date
- Sheet
- Size
- A3
- of
- Rev
- (in symbol 74AVC20T245) 0; 1

### Library data of the parts
C21-C24 = CC0201_100NF_6.3V_10%_X5R: as C1 on sheet ADC; Part Number: CC0201_100NF_6.3V_10%_X5R; Component Kind: Standard; Component Type: Standard; Pin Count: 2; Value: 100nF; Status: Not Recommended; Manufacturer Part Number: CC0201_100NF_6.3V_10%_X5R; Case: 0201; Mounted: Yes; Socket: No; SMD: Yes; Manufacturer1 Example: AVX; Manufacturer1 ComponentHeight: 0.33mm; HelpURL: \\cern.ch\dfs\Applications\Altium\Datasheets\CC0201_X5R_AVX.pdf; Author: CERN DEM JLC; CreateDate: 2007-12-03; LatestRevisionDate: 2007-12-03
IC15 = 74AVC20T245: 20-BIT DUAL SUPPLY BUS TRANSCEIVER; Supplier 1: Digi-Key; Supplier Part Number 1: 296-19097-1-ND; partnumber: SN74AVC20T245ZQLR
L14 = IND0805_MURATA_BLM21PG221SN1D: as L4 on sheet ADC; Part Number: IND0805_MURATA_BLM21PG221SN1D; Component Kind: Standard; Component Type: Standard; Pin Count: 2; Value: 220R@100MHz; Status: None; Manufacturer Part Number: BLM21PG221SN1D; Case: 0805; Mounted: Yes; Socket: No; SMD: Yes; ComponentHeight: 1.05mm; HelpURL: \\cern.ch\dfs\Applications\Altium\Datasheets\IND0402_MURATA_BLM21P.pdf; Author: CERN DEM JLC; CreateDate: 25/1/2010; LatestRevisionDate: 25/1/2010

## Nets that join several sheets
3P3VAUX: FMC connector (J9.d32), EEPROM_Temp_LEDs (12 pins)
GND: FMC_130MSPS_4CH (25 pins), power_supply (114 pins), FMC connector (164 pins), Clock_circuit (87 pins), EEPROM_Temp_LEDs (17 pins), U_ADC1 (33 pins), Triggers (9 pins), U_ADC2 (33 pins), U_ADC3 (33 pins), U_ADC4 (33 pins), U_BUFFER2 (16 pins), U_BUFFER3 (16 pins), U_BUFFER1 (16 pins), U_BUFFER4 (16 pins)
P1V8: power_supply (C92.2 IC10.1 IC10.3 IC10.20), U_ADC1 (L4A.1), U_ADC2 (L4B.1), U_ADC3 (L4C.1), U_ADC4 (L4D.1), U_BUFFER2 (6 pins), U_BUFFER3 (6 pins), U_BUFFER1 (6 pins), U_BUFFER4 (6 pins)
P3V3: FMC_130MSPS_4CH (C37.2 IC14.1), power_supply (L9.1), FMC connector (5 pins), EEPROM_Temp_LEDs (LD1.2), Triggers (5 pins)
P3V3_ADC1: power_supply (L3.2), U_ADC1 (12 pins)
P3V3_ADC2: power_supply (L6.2), U_ADC2 (12 pins)
P3V3_ADC3: power_supply (L12.2), U_ADC3 (12 pins)
P3V3_ADC4: power_supply (L13.2), U_ADC4 (12 pins)
P3V3_CLK: power_supply (L7.2), Clock_circuit (47 pins)
P12V0: power_supply (26 pins), FMC connector (J9.c35 J9.c37)
VADJ: FMC_130MSPS_4CH (C39.2 IC14.16), power_supply (R78.1), FMC connector (J9.e39 J9.f40 J9.g39 J9.h40), U_BUFFER2 (L14A.2), U_BUFFER3 (L14B.2), U_BUFFER1 (L14C.2), U_BUFFER4 (L14D.2)
ADC1_CLK_N: Clock_circuit (R57.2 R69.2), U_ADC1 (C11A.1)
ADC1_CLK_P: Clock_circuit (R56.2 R68.2), U_ADC1 (C9A.1)
ADC2_CLK_N: Clock_circuit (R41.2 R71.2), U_ADC2 (C11B.1)
ADC2_CLK_P: Clock_circuit (R33.2 R70.2), U_ADC2 (C9B.1)
ADC3_CLK_N: Clock_circuit (R61.2 R63.2), U_ADC3 (C11C.1)
ADC3_CLK_P: Clock_circuit (R60.2 R62.2), U_ADC3 (C9C.1)
ADC4_CLK_N: Clock_circuit (R59.2 R67.2), U_ADC4 (C11D.1)
ADC4_CLK_P: Clock_circuit (R58.2 R66.2), U_ADC4 (C9D.1)
B_CLKOUTA: FMC connector (J9.d20), U_BUFFER1 (IC15C.A1)
B_CLKOUTA: FMC connector (J9.e2), U_BUFFER4 (IC15D.A1)
B_CLKOUTA: FMC connector (J9.g6), U_BUFFER3 (IC15B.A1)
B_CLKOUTA: FMC connector (J9.k16), U_BUFFER2 (IC15A.A1)
B_DA0: FMC connector (J9.j10), U_BUFFER4 (IC15D.J2)
B_DA0: FMC connector (J9.j22), U_BUFFER2 (IC15A.J2)
B_DA0: FMC connector (J9.g15), U_BUFFER3 (IC15B.J2)
B_DA0: FMC connector (J9.h28), U_BUFFER1 (IC15C.J2)
B_DA1: FMC connector (J9.g16), U_BUFFER3 (IC15B.J1)
B_DA1: FMC connector (J9.h29), U_BUFFER1 (IC15C.J1)
B_DA1: FMC connector (J9.k10), U_BUFFER4 (IC15D.J1)
B_DA1: FMC connector (J9.k22), U_BUFFER2 (IC15A.J1)
B_DA2: FMC connector (J9.g27), U_BUFFER1 (IC15C.H2)
B_DA2: FMC connector (J9.h13), U_BUFFER3 (IC15B.H2)
B_DA2: FMC connector (J9.k8), U_BUFFER4 (IC15D.H2)
B_DA2: FMC connector (J9.k20), U_BUFFER2 (IC15A.H2)
B_DA3: FMC connector (J9.j9), U_BUFFER4 (IC15D.H1)
B_DA3: FMC connector (J9.j21), U_BUFFER2 (IC15A.H1)
B_DA3: FMC connector (J9.g28), U_BUFFER1 (IC15C.H1)
B_DA3: FMC connector (J9.h14), U_BUFFER3 (IC15B.H1)
B_DA4: FMC connector (J9.g12), U_BUFFER3 (IC15B.G2)
B_DA4: FMC connector (J9.h25), U_BUFFER1 (IC15C.G2)
B_DA4: FMC connector (J9.k7), U_BUFFER4 (IC15D.G2)
B_DA4: FMC connector (J9.k19), U_BUFFER2 (IC15A.G2)
B_DA5: FMC connector (J9.f10), U_BUFFER4 (IC15D.G1)
B_DA5: FMC connector (J9.f20), U_BUFFER2 (IC15A.G1)
B_DA5: FMC connector (J9.g13), U_BUFFER3 (IC15B.G1)
B_DA5: FMC connector (J9.h26), U_BUFFER1 (IC15C.G1)
B_DA6: FMC connector (J9.d11), U_BUFFER3 (IC15B.F2)
B_DA6: FMC connector (J9.j6), U_BUFFER4 (IC15D.F2)
B_DA6: FMC connector (J9.j18), U_BUFFER2 (IC15A.F2)
B_DA6: FMC connector (J9.g24), U_BUFFER1 (IC15C.F2)
B_DA7: FMC connector (J9.d12), U_BUFFER3 (IC15B.F1)
B_DA7: FMC connector (J9.j7), U_BUFFER4 (IC15D.F1)
B_DA7: FMC connector (J9.j19), U_BUFFER2 (IC15A.F1)
B_DA7: FMC connector (J9.g25), U_BUFFER1 (IC15C.F1)
B_DA8: FMC connector (J9.d24), U_BUFFER1 (IC15C.E2)
B_DA8: FMC connector (J9.e9), U_BUFFER4 (IC15D.E2)
B_DA8: FMC connector (J9.j16), U_BUFFER2 (IC15A.E2)
B_DA8: FMC connector (J9.h10), U_BUFFER3 (IC15B.E2)
B_DA9: FMC connector (J9.e10), U_BUFFER4 (IC15D.E1)
B_DA9: FMC connector (J9.f17), U_BUFFER2 (IC15A.E1)
B_DA9: FMC connector (J9.h11), U_BUFFER3 (IC15B.E1)
B_DA9: FMC connector (J9.h23), U_BUFFER1 (IC15C.E1)
B_DA10: FMC connector (J9.c23), U_BUFFER1 (IC15C.D2)
B_DA10: FMC connector (J9.f7), U_BUFFER4 (IC15D.D2)
B_DA10: FMC connector (J9.j15), U_BUFFER2 (IC15A.D2)
B_DA10: FMC connector (J9.g9), U_BUFFER3 (IC15B.D2)
B_DA11: FMC connector (J9.d23), U_BUFFER1 (IC15C.D1)
B_DA11: FMC connector (J9.f8), U_BUFFER4 (IC15D.D1)
B_DA11: FMC connector (J9.f16), U_BUFFER2 (IC15A.D1)
B_DA11: FMC connector (J9.g10), U_BUFFER3 (IC15B.D1)
B_DA12: FMC connector (J9.e6), U_BUFFER4 (IC15D.C2)
B_DA12: FMC connector (J9.j13), U_BUFFER2 (IC15A.C2)
B_DA12: FMC connector (J9.g22), U_BUFFER1 (IC15C.C2)
B_DA12: FMC connector (J9.h8), U_BUFFER3 (IC15B.C2)
B_DA13: FMC connector (J9.d9), U_BUFFER3 (IC15B.C1)
B_DA13: FMC connector (J9.e7), U_BUFFER4 (IC15D.C1)
B_DA13: FMC connector (J9.h22), U_BUFFER1 (IC15C.C1)
B_DA13: FMC connector (J9.k14), U_BUFFER2 (IC15A.C1)
B_DA14: FMC connector (J9.c22), U_BUFFER1 (IC15C.B2)
B_DA14: FMC connector (J9.f4), U_BUFFER4 (IC15D.B2)
B_DA14: FMC connector (J9.j12), U_BUFFER2 (IC15A.B2)
B_DA14: FMC connector (J9.h7), U_BUFFER3 (IC15B.B2)
B_DA15: FMC connector (J9.d8), U_BUFFER3 (IC15B.B1)
B_DA15: FMC connector (J9.f5), U_BUFFER4 (IC15D.B1)
B_DA15: FMC connector (J9.g21), U_BUFFER1 (IC15C.B1)
B_DA15: FMC connector (J9.k13), U_BUFFER2 (IC15A.B1)
B_OVFL_A: FMC connector (J9.g30), U_BUFFER1 (IC15C.K2)
B_OVFL_A: FMC connector (J9.h16), U_BUFFER3 (IC15B.K2)
B_OVFL_A: FMC connector (J9.k11), U_BUFFER4 (IC15D.K2)
B_OVFL_A: FMC connector (J9.k23), U_BUFFER2 (IC15A.K2)
CH1.CLKOUTA: U_ADC1 (IC1A.41), U_BUFFER1 (IC15C.K5)
CH1.DA0: U_ADC1 (IC1A.42), U_BUFFER1 (IC15C.J5)
CH1.DA1: U_ADC1 (IC1A.43), U_BUFFER1 (IC15C.J6)
CH1.DA2: U_ADC1 (IC1A.44), U_BUFFER1 (IC15C.H5)
CH1.DA3: U_ADC1 (IC1A.45), U_BUFFER1 (IC15C.H6)
CH1.DA4: U_ADC1 (IC1A.46), U_BUFFER1 (IC15C.G5)
CH1.DA5: U_ADC1 (IC1A.47), U_BUFFER1 (IC15C.G6)
CH1.DA6: U_ADC1 (IC1A.48), U_BUFFER1 (IC15C.F5)
CH1.DA7: U_ADC1 (IC1A.51), U_BUFFER1 (IC15C.F6)
CH1.DA8: U_ADC1 (IC1A.52), U_BUFFER1 (IC15C.E5)
CH1.DA9: U_ADC1 (IC1A.53), U_BUFFER1 (IC15C.E6)
CH1.DA10: U_ADC1 (IC1A.54), U_BUFFER1 (IC15C.D5)
CH1.DA11: U_ADC1 (IC1A.55), U_BUFFER1 (IC15C.D6)
CH1.DA12: U_ADC1 (IC1A.56), U_BUFFER1 (IC15C.C5)
CH1.DA13: U_ADC1 (IC1A.57), U_BUFFER1 (IC15C.C6)
CH1.DA14: U_ADC1 (IC1A.58), U_BUFFER1 (IC15C.B5)
CH1.DA15: U_ADC1 (IC1A.59), U_BUFFER1 (IC15C.B6)
CH1.OF_A: U_ADC1 (IC1A.60), U_BUFFER1 (IC15C.A6)
CH2.CLKOUTA: U_ADC2 (IC1B.41), U_BUFFER2 (IC15A.K5)
CH2.DA0: U_ADC2 (IC1B.42), U_BUFFER2 (IC15A.J5)
CH2.DA1: U_ADC2 (IC1B.43), U_BUFFER2 (IC15A.J6)
CH2.DA2: U_ADC2 (IC1B.44), U_BUFFER2 (IC15A.H5)
CH2.DA3: U_ADC2 (IC1B.45), U_BUFFER2 (IC15A.H6)
CH2.DA4: U_ADC2 (IC1B.46), U_BUFFER2 (IC15A.G5)
CH2.DA5: U_ADC2 (IC1B.47), U_BUFFER2 (IC15A.G6)
CH2.DA6: U_ADC2 (IC1B.48), U_BUFFER2 (IC15A.F5)
CH2.DA7: U_ADC2 (IC1B.51), U_BUFFER2 (IC15A.F6)
CH2.DA8: U_ADC2 (IC1B.52), U_BUFFER2 (IC15A.E5)
CH2.DA9: U_ADC2 (IC1B.53), U_BUFFER2 (IC15A.E6)
CH2.DA10: U_ADC2 (IC1B.54), U_BUFFER2 (IC15A.D5)
CH2.DA11: U_ADC2 (IC1B.55), U_BUFFER2 (IC15A.D6)
CH2.DA12: U_ADC2 (IC1B.56), U_BUFFER2 (IC15A.C5)
CH2.DA13: U_ADC2 (IC1B.57), U_BUFFER2 (IC15A.C6)
CH2.DA14: U_ADC2 (IC1B.58), U_BUFFER2 (IC15A.B5)
CH2.DA15: U_ADC2 (IC1B.59), U_BUFFER2 (IC15A.B6)
CH2.OF_A: U_ADC2 (IC1B.60), U_BUFFER2 (IC15A.A6)
CH3.CLKOUTA: U_ADC3 (IC1C.41), U_BUFFER3 (IC15B.K5)
CH3.DA0: U_ADC3 (IC1C.42), U_BUFFER3 (IC15B.J5)
CH3.DA1: U_ADC3 (IC1C.43), U_BUFFER3 (IC15B.J6)
CH3.DA2: U_ADC3 (IC1C.44), U_BUFFER3 (IC15B.H5)
CH3.DA3: U_ADC3 (IC1C.45), U_BUFFER3 (IC15B.H6)
CH3.DA4: U_ADC3 (IC1C.46), U_BUFFER3 (IC15B.G5)
CH3.DA5: U_ADC3 (IC1C.47), U_BUFFER3 (IC15B.G6)
CH3.DA6: U_ADC3 (IC1C.48), U_BUFFER3 (IC15B.F5)
CH3.DA7: U_ADC3 (IC1C.51), U_BUFFER3 (IC15B.F6)
CH3.DA8: U_ADC3 (IC1C.52), U_BUFFER3 (IC15B.E5)
CH3.DA9: U_ADC3 (IC1C.53), U_BUFFER3 (IC15B.E6)
CH3.DA10: U_ADC3 (IC1C.54), U_BUFFER3 (IC15B.D5)
CH3.DA11: U_ADC3 (IC1C.55), U_BUFFER3 (IC15B.D6)
CH3.DA12: U_ADC3 (IC1C.56), U_BUFFER3 (IC15B.C5)
CH3.DA13: U_ADC3 (IC1C.57), U_BUFFER3 (IC15B.C6)
CH3.DA14: U_ADC3 (IC1C.58), U_BUFFER3 (IC15B.B5)
CH3.DA15: U_ADC3 (IC1C.59), U_BUFFER3 (IC15B.B6)
CH3.OF_A: U_ADC3 (IC1C.60), U_BUFFER3 (IC15B.A6)
CH4.CLKOUTA: U_ADC4 (IC1D.41), U_BUFFER4 (IC15D.K5)
CH4.DA0: U_ADC4 (IC1D.42), U_BUFFER4 (IC15D.J5)
CH4.DA1: U_ADC4 (IC1D.43), U_BUFFER4 (IC15D.J6)
CH4.DA2: U_ADC4 (IC1D.44), U_BUFFER4 (IC15D.H5)
CH4.DA3: U_ADC4 (IC1D.45), U_BUFFER4 (IC15D.H6)
CH4.DA4: U_ADC4 (IC1D.46), U_BUFFER4 (IC15D.G5)
CH4.DA5: U_ADC4 (IC1D.47), U_BUFFER4 (IC15D.G6)
CH4.DA6: U_ADC4 (IC1D.48), U_BUFFER4 (IC15D.F5)
CH4.DA7: U_ADC4 (IC1D.51), U_BUFFER4 (IC15D.F6)
CH4.DA8: U_ADC4 (IC1D.52), U_BUFFER4 (IC15D.E5)
CH4.DA9: U_ADC4 (IC1D.53), U_BUFFER4 (IC15D.E6)
CH4.DA10: U_ADC4 (IC1D.54), U_BUFFER4 (IC15D.D5)
CH4.DA11: U_ADC4 (IC1D.55), U_BUFFER4 (IC15D.D6)
CH4.DA12: U_ADC4 (IC1D.56), U_BUFFER4 (IC15D.C5)
CH4.DA13: U_ADC4 (IC1D.57), U_BUFFER4 (IC15D.C6)
CH4.DA14: U_ADC4 (IC1D.58), U_BUFFER4 (IC15D.B5)
CH4.DA15: U_ADC4 (IC1D.59), U_BUFFER4 (IC15D.B6)
CH4.OF_A: U_ADC4 (IC1D.60), U_BUFFER4 (IC15D.A6)
CLK0_M2C_N: FMC connector (J9.h5), Clock_circuit (IC3.24)
CLK0_M2C_P: FMC connector (J9.h4), Clock_circuit (IC3.25)
DITH: FMC_130MSPS_4CH (IC14.12), FMC connector (J9.c14)
DITH_ON_OFF: FMC_130MSPS_4CH (IC14.5), U_ADC1 (IC1A.20), U_ADC2 (IC1B.20), U_ADC3 (IC1C.20), U_ADC4 (IC1D.20)
FMC_REFCLK_N: FMC connector (R27.1), Clock_circuit (IC16.3 R22.1)
FMC_REFCLK_P: FMC connector (R23.1), Clock_circuit (IC16.4 R22.2)
FUNCTION: FMC connector (J9.c19), Clock_circuit (IC3.16)
GA0: FMC connector (J9.c34), EEPROM_Temp_LEDs (IC5.2)
GA1: FMC connector (J9.d35), EEPROM_Temp_LEDs (IC5.1)
HA12_N: FMC connector (J9.f14), Clock_circuit (OSC2.8 R50.1)
HA12_P: FMC connector (J9.f13), Clock_circuit (OSC2.2)
HA13_P: FMC connector (J9.e12), Clock_circuit (OSC2.7 R49.1)
LA06_N: FMC_130MSPS_4CH (IC14.11), FMC connector (J9.c11)
LA06_P: FMC_130MSPS_4CH (IC14.10), FMC connector (J9.c10)
LA09_N: FMC connector (J9.d15), Clock_circuit (IC3.19)
LA09_P: FMC connector (J9.d14), Clock_circuit (R19.1)
LA10_N: FMC_130MSPS_4CH (IC14.13), FMC connector (J9.c15)
LA13_N: FMC connector (J9.d18), Clock_circuit (IC3.21)
LA13_P: FMC connector (J9.d17), Clock_circuit (IC3.18)
LA14_P: FMC connector (J9.c18), Clock_circuit (R7.1)
LA16_N: FMC connector (J9.g19), EEPROM_Temp_LEDs (Q1.2)
LA16_P: FMC connector (J9.g18), EEPROM_Temp_LEDs (Q1.5)
LA26_N: FMC connector (J9.d27), Triggers (Q2.5 Q5.5 R88.2)
LA26_P: FMC connector (J9.d26), EEPROM_Temp_LEDs (Q2.2)
LA27_N: FMC connector (J9.c27), EEPROM_Temp_LEDs (R35.2)
LA27_P: FMC connector (J9.c26), EEPROM_Temp_LEDs (R37.2)
LA28_N: FMC connector (J9.h32), EEPROM_Temp_LEDs (IC2.3 IC13.3 R5.1)
LA28_P: FMC connector (J9.h31), Triggers (IC17.2 IC17.3 Q5.2)
LA31_N: power_supply (IC8.G12 R78.2), FMC connector (J9.g34)
LA31_P: FMC connector (J9.g33), Clock_circuit (IC16.9 R48.2)
LA32_N: FMC connector (J9.h38), Triggers (IC17.7 R75.1)
LA32_P: FMC connector (J9.h37), Triggers (IC17.6 R75.2)
NetJ5_1: FMC_130MSPS_4CH (J5.1), U_ADC4 (L2D.1 R11D.2)
NetJ6_1: FMC_130MSPS_4CH (J6.1), U_ADC1 (L2A.1 R11A.2)
NetJ7_1: FMC_130MSPS_4CH (J7.1), U_ADC3 (L2C.1 R11C.2)
NetJ8_1: FMC_130MSPS_4CH (J8.1), U_ADC2 (L2B.1 R11B.2)
PGA_1_0: FMC_130MSPS_4CH (IC14.7), U_ADC1 (IC1A.64), U_ADC2 (IC1B.64), U_ADC3 (IC1C.64), U_ADC4 (IC1D.64)
RAND_ON_OFF: FMC_130MSPS_4CH (IC14.6), U_ADC1 (IC1A.63), U_ADC2 (IC1B.63), U_ADC3 (IC1C.63), U_ADC4 (IC1D.63)
RF3: FMC_130MSPS_4CH (J1.1), Triggers (D1.3 IC17.1 IC17.4 R87.2)
SCL: FMC connector (J9.c30), EEPROM_Temp_LEDs (IC5.6 R42.2 R44.1)
SDA: FMC connector (J9.c31), EEPROM_Temp_LEDs (IC5.5 R39.2 R43.1)
SHDN_ON_OFF: FMC_130MSPS_4CH (IC14.4), U_ADC1 (IC1A.19), U_ADC2 (IC1B.19), U_ADC3 (IC1C.19), U_ADC4 (IC1D.19)

## Assembly variants
passive clock: not fitted C5A C5B C5C C5D L5 L8 R11A R11B R11C R11D R51 R62 R63 R66 R67 R68 R69 R70 R71 R72 R73 R81 R82 R83 TR1A TR1B TR1C TR1D
active clock: not fitted C5A C5B C5C C5D C40 R11A R11B R11C R11D R24 R33 R41 R56 R57 R58 R59 R60 R61 R81 R82 R83 TR1A TR1B TR1C TR1D